# EAGLE design pas_ant (EAGLE 9.3.0)
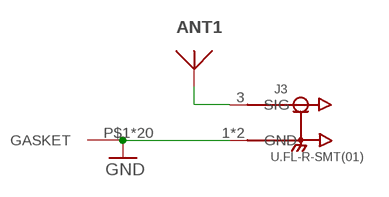
[diagram p0: schematic, sheet 1]

## Parts
ANT1  ANT1590-2540A  [2540A]
J3  U.FL-R-SMT(01)  [HRS_U.FL-R-SMT(01)]
U$1  2118718-2  [2118717-2]

## Nets
GND2: J3.1(GND) J3.2(GND) U$1.P$1(GASKET) U$1.P$2(GASKET) U$1.P$3(GASKET) U$1.P$4(GASKET) U$1.P$5(GASKET) U$1.P$6(GASKET) U$1.P$7(GASKET) U$1.P$8(GASKET) U$1.P$9(GASKET) U$1.P$10(GASKET) U$1.P$11(GASKET) U$1.P$12(GASKET) U$1.P$13(GASKET) U$1.P$14(GASKET) U$1.P$15(GASKET) U$1.P$16(GASKET) U$1.P$17(GASKET) U$1.P$18(GASKET) U$1.P$19(GASKET) U$1.P$20(GASKET) ; supply symbol labelled GND
N$2 [50_feed]: ANT1.P$1 J3.3(SIG)

## Library data of the parts
ANT1 = parts-srpassives:ANT1590-
J3 = parts-molex:U.FL-R-SMT(01): U.FL Series 6 Ghz 50 Ohm Ultra-small SMT Coaxial Cable Receptacle; AVAILABILITY: Unavailable; DESCRIPTION: U.FL Series 6 Ghz 50 Ohm Ultra-small SMT Coaxial Cable Receptacle; MF: Hirose; MP: U.FL-R-SMT_01_; PACKAGE: None; PRICE: None
U$1 = parts-te_conn:2118718-2

## Net classes
1 50_feed: width 1 mm, clearance 0.4 mm

## Board
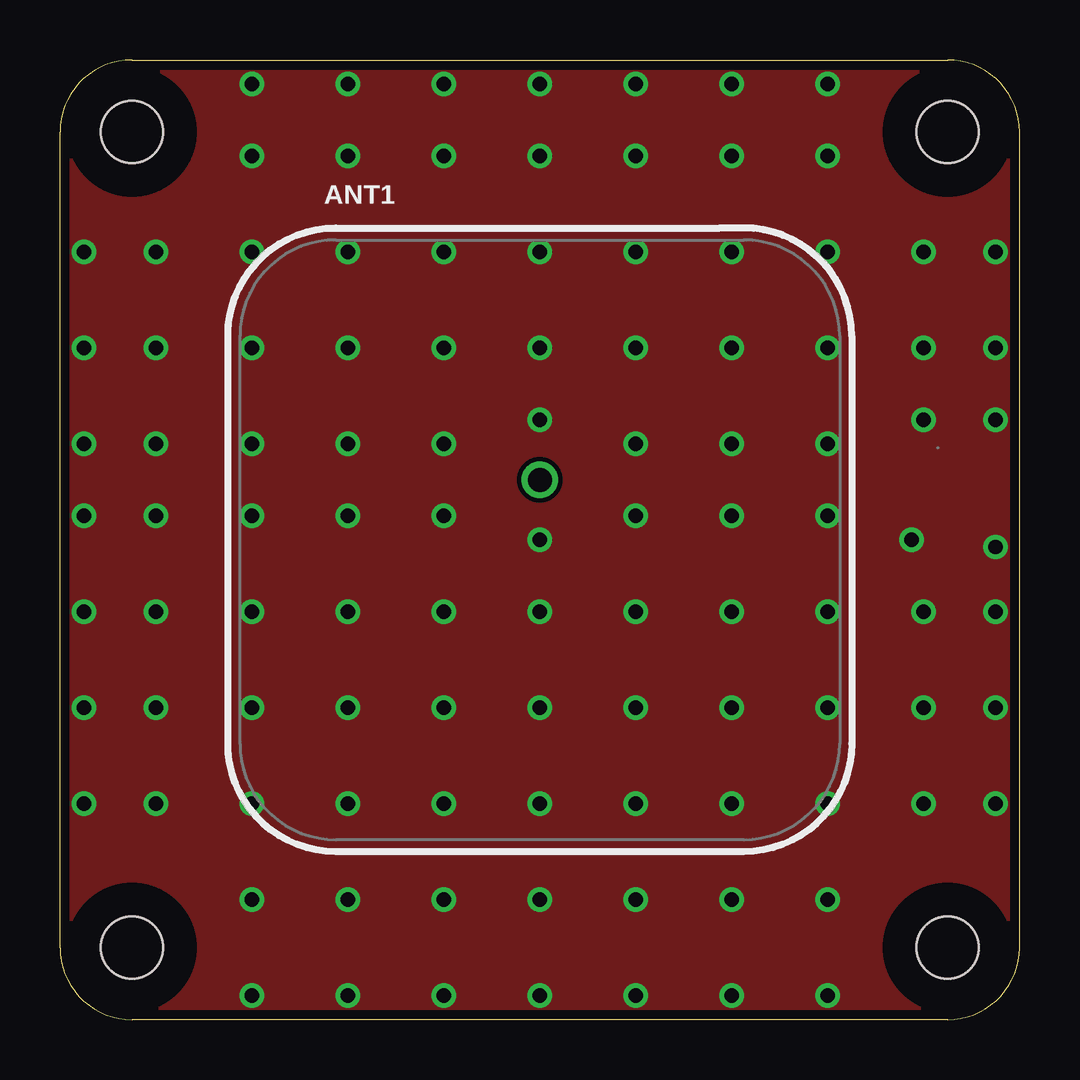
[diagram p1: board, top side]
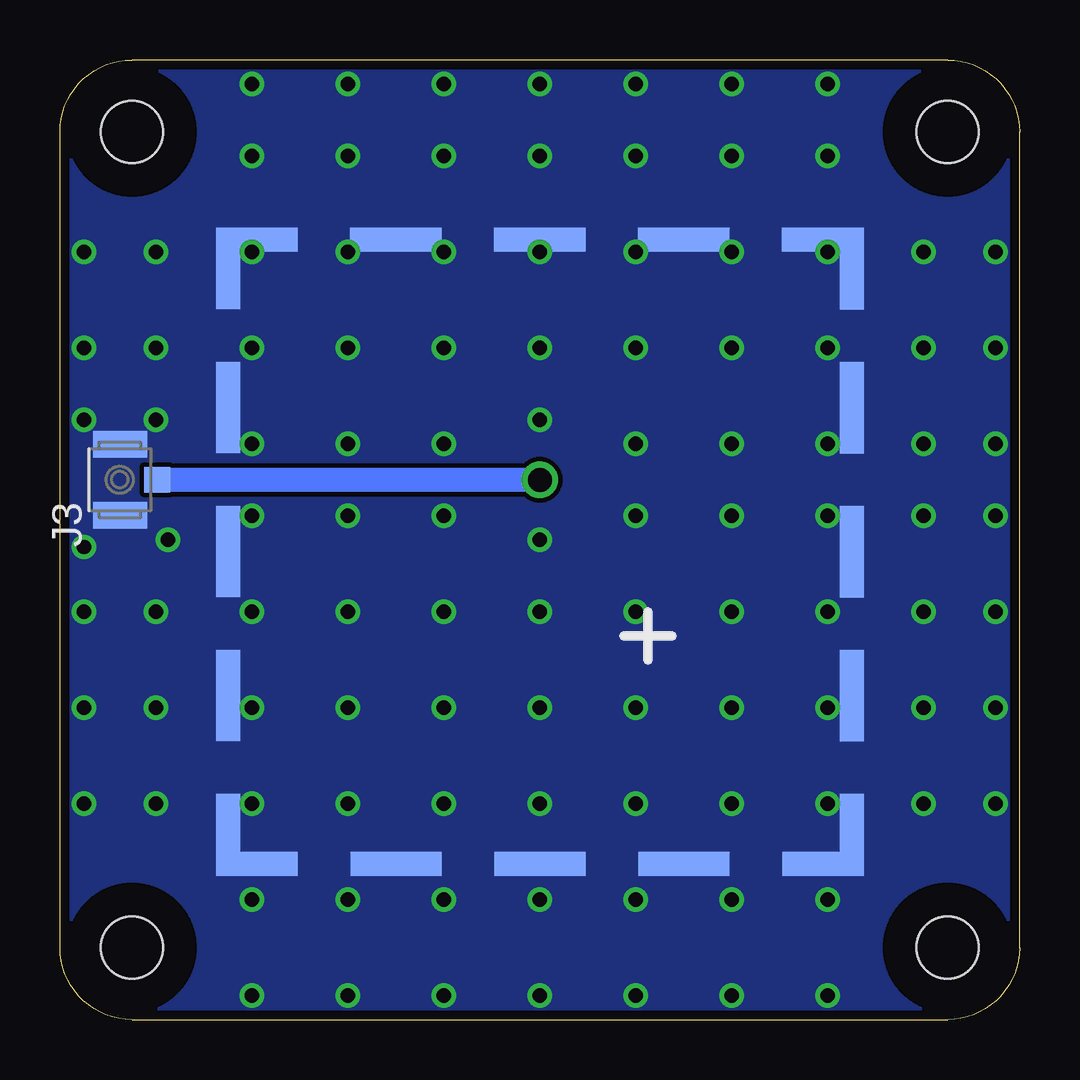
[diagram p2: board, bottom side, seen from below]

Size 40 x 40 mm. Coordinates in mm from the lower left corner, seen from the top.
Outline: 3,40 37,40 arc-90 40,37 40,3 arc-90 37,0 3,0 arc-90 0,3 0,37 arc-90 3,40
Copper layers (1*16): Top 0.035mm / dielectric 1.5mm / Bottom 0.035mm
Design rules "default *": minimum track width 6mil, minimum drill 0.35mm, track to track 6mil, track to pad 6mil, pad to pad 6mil, via to via 6mil, smd to smd 6mil, copper to edge 0.4mm, drill to drill 6mil, minimum pad ring 10mil, minimum via ring 8mil, stop-mask expansion 4mil, vias tented up to drill 0mil, thermal gap 10mil
Holes 2.6 mm at 3,37 37,37 3,3 37,3
tRestrict: area 0.5,34.5 to 5.5,39.5; area 34.5,34.5 to 39.5,39.5; area 0.5,0.5 to 5.5,5.5; area 34.5,0.5 to 39.5,5.5
bRestrict: area 0.5,34.5 to 5.5,39.5; area 34.5,34.5 to 39.5,39.5; area 0.5,0.5 to 5.5,5.5; area 34.5,0.5 to 39.5,5.5

### Footprints (pad centres in the part's own frame; a part is rotated, then mirrored left to right if it is on the bottom)
2540A = drill 1: P$1 0,2.5
HRS_U.FL-R-SMT(01) = smd 1.1 x 2.25: 1 -1.475,0; 2 1.475,0 | smd 1.05 x 1.1: 3 0,-1.55
2118717-2 = smd 1 x 3.41: P$1 0.5,1.705; P$11 26.51,25.305 | smd 1 x 3.8: P$2 0.5,7.51; P$3 0.5,13.51; P$4 0.5,19.51; P$12 26.51,19.5; P$13 26.51,13.5; P$14 26.51,7.5 | smd 1 x 3.4: P$5 0.5,25.31; P$15 26.51,1.7 | smd 3.41 x 1: P$6 1.705,0.5; P$16 25.305,26.51 | smd 3.8 x 1: P$7 7.51,0.5; P$8 13.51,0.5; P$9 19.51,0.5; P$17 19.5,26.51; P$18 13.5,26.51; P$19 7.5,26.51 | smd 3.4 x 1: P$10 25.31,0.5; P$20 1.7,26.51

### Placement (x,y rotation side)
ANT1  20,20 0 top
J3  37.5,22.5 90 bottom
U$1  33.5,6 0 bottom

### Tracks (layer width: path | path; a pad name or v marks a point on that pad's centre or on a via)
GND2  (via drill 0.6)
  other vias: 8,1 12,1 16,1 20,1 24,1 28,1 32,1 8,5 12,5 16,5 20,5 24,5 28,5 32,5 8,9 12,9 16,9 20,9 24,9 28,9 32,9 8,13 12,13 16,13 20,13 24,13 28,13 32,13 8,17 12,17 16,17 20,17 24,17 28,17 32,17 8,21 12,21 16,21 20,20 24,21 28,21 32,21 8,24 12,24 16,24 20,25 24,24 28,24 32,24 8,28 12,28 16,28 20,28 24,28 28,28 32,28 8,32 12,32 16,32 20,32 24,32 28,32 32,32 8,36 12,36 16,36 20,36 24,36 28,36 32,36 8,39 12,39 16,39 20,39 24,39 28,39 32,39 4,9 4,13 4,17 4,21 4,24 4,28 4,32 1,9 1,13 1,17 1,21 1,24 1,28 1,32 36,32 36,28 36,25 35.5,20 36,17 36,13 36,9 39,32 39,28 39,25 39,19.7 39,17 39,13 39,9
  pour Top (isolate 0.2, rank 6, no thermals): -2,-2 42,-2 42,42 -2,42
  pour Bottom (isolate 0.2, no thermals): -1,-1 41,-1 41,41 -1,41
N$2
  Bottom 1: ANT1.P$1 J3.3